# Altium schematic sheet stm32g474.schdoc
size 209 x 297 mm
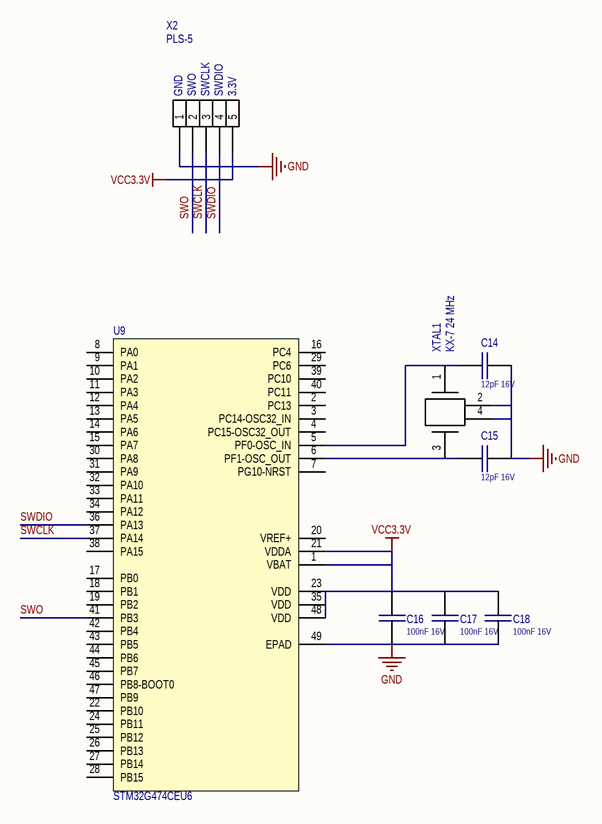
[diagram p0: stm32g474.schdoc]

## Parts
C14  12pF 16V  [C_0603]
C15  12pF 16V  [C_0603]
C16  100nF 16V  [C_0603]
C17  100nF 16V  [C_0603]
C18  100nF 16V  [C_0603]
U9  STM32G474CEU6  [STM-UFQFPN48_M]
X2  PLS-5  [PLS-5-3D]
XTAL1  KX-7 24 MHz  [KX - 7]

## Nets
GND: C14.2 C15.2 C16.1 C17.1 C18.1 U9.49(EPAD) X2.1 XTAL1.2(GND) XTAL1.4
VCC3.3V: C16.2 C17.2 C18.2 U9.1(VBAT) U9.21(VDDA) U9.23(VDD) U9.35(VDD) U9.48(VDD) X2.5
SWCLK: U9.37(PA14) X2.3
SWDIO: U9.36(PA13) X2.4
SWO: U9.41(PB3) X2.2
NetC14_1: C14.1 U9.5(PF0-OSC_IN) XTAL1.1
NetC15_1: C15.1 U9.6(PF1-OSC_OUT) XTAL1.3

Not connected (* = marked no-connect by the designer): U9 2(PC13) 3(PC14-OSC32_IN) 4(PC15-OSC32_OUT) 7(PG10-NRST) 8(PA0) 9(PA1) 10(PA2) 11(PA3) 12(PA4) 13(PA5) 14(PA6) 15(PA7) 16(PC4) 17(PB0) 18(PB1) 19(PB2) 20(VREF+) 22(PB10) 24(PB11) 25(PB12) 26(PB13) 27(PB14) 28(PB15) 29(PC6) 30(PA8) 31(PA9) 32(PA10) 33(PA11) 34(PA12) 38(PA15) 39(PC10) 40(PC11) 42(PB4) 43(PB5) 44(PB6) 45(PB7) 46(PB8-BOOT0) 47(PB9)

## Notes on the sheet
- (in symbol PLS2-5) GND; SWO; SWCLK; SWDIO; 3.3V

## Library data of the parts
C14-C18 = C0603: Capacitor
  C14 C15: Value: 12pF 16V
  C16-C18: Value: 100nF 16V
U9 = STM32G474CEU6: MCU
X2 = PLS2-5: Header, 5-Pin; LatestRevisionDate: 17-Jul-2002; LatestRevisionNote: Re-released for DXP Platform.; Publisher: Altium Limited
XTAL1 = KX-7: Quartz